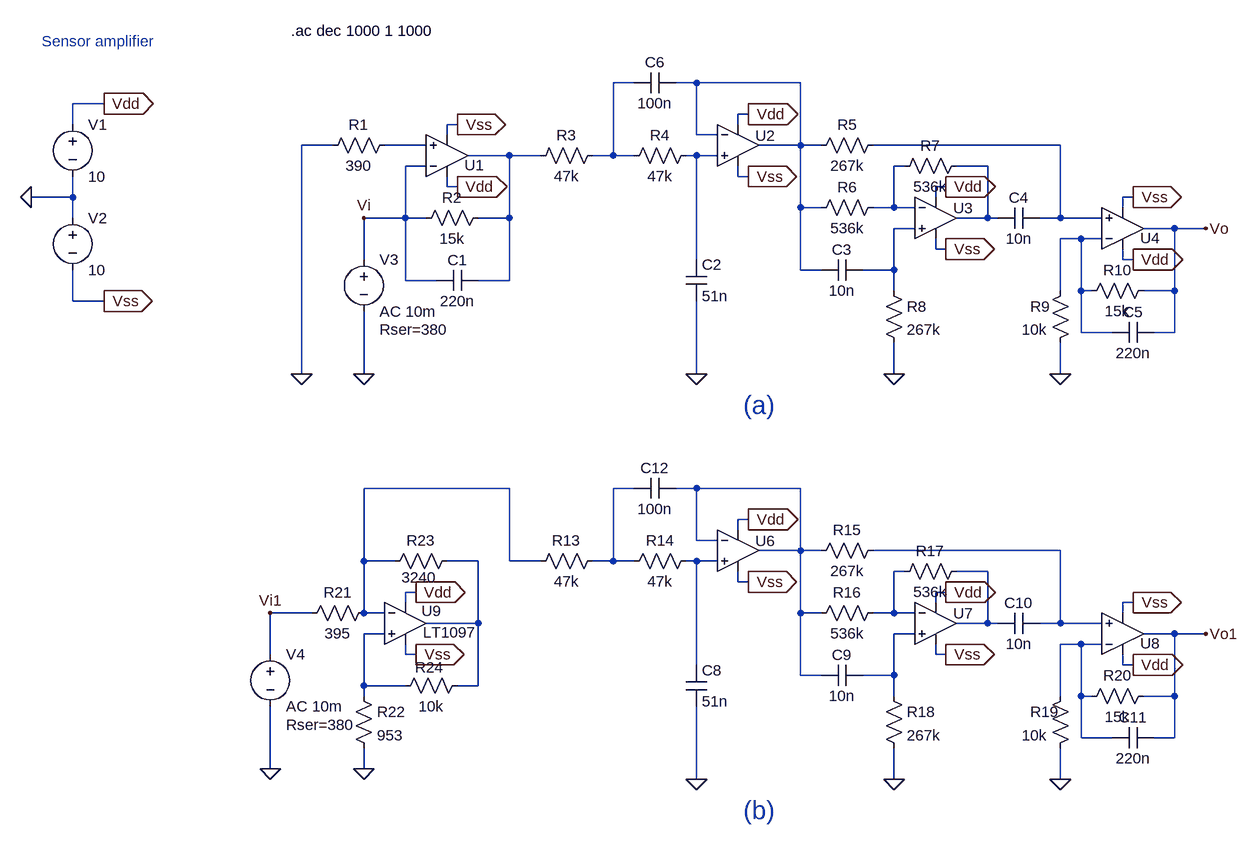
[diagram p0: schematic sensor amplifier2.asc]
sensor amplifier2.asc, the LTspice schematic file:
Version 4
SHEET 1 1816 1412
WIRE 880 -48 848 -48
WIRE 976 -48 944 -48
WIRE 1136 -48 976 -48
WIRE 64 -16 16 -16
WIRE 1056 0 1040 0
WIRE 16 16 16 -16
WIRE 608 16 592 16
WIRE 1040 16 1040 0
WIRE 592 32 592 16
WIRE 976 32 976 -48
WIRE 1008 32 976 32
WIRE 416 48 368 48
WIRE 560 48 496 48
WIRE 1136 48 1136 -48
WIRE 1136 48 1072 48
WIRE 1168 48 1136 48
WIRE 1536 48 1248 48
WIRE 688 64 624 64
WIRE 736 64 688 64
WIRE 848 64 848 -48
WIRE 848 64 816 64
WIRE 880 64 848 64
WIRE 976 64 960 64
WIRE 1008 64 976 64
WIRE 560 80 528 80
WIRE 1296 80 1280 80
WIRE 1424 80 1376 80
WIRE 1040 96 1040 80
WIRE 1056 96 1040 96
WIRE 592 112 592 96
WIRE 608 112 592 112
WIRE 1360 112 1344 112
WIRE 16 128 16 96
WIRE 16 128 -48 128
WIRE 1344 128 1344 112
WIRE 1648 128 1632 128
WIRE 1136 144 1136 48
WIRE 1168 144 1136 144
WIRE 1280 144 1280 80
WIRE 1280 144 1248 144
WIRE 1312 144 1280 144
WIRE 1632 144 1632 128
WIRE 16 160 16 128
WIRE 528 160 528 80
WIRE 528 160 464 160
WIRE 560 160 528 160
WIRE 688 160 688 64
WIRE 688 160 640 160
WIRE 1424 160 1424 80
WIRE 1424 160 1376 160
WIRE 1440 160 1424 160
WIRE 1536 160 1536 48
WIRE 1536 160 1504 160
WIRE 1600 160 1536 160
WIRE 1312 176 1280 176
WIRE 1712 176 1664 176
WIRE 1760 176 1712 176
WIRE 1568 192 1536 192
WIRE 1600 192 1568 192
WIRE 1344 208 1344 192
WIRE 1360 208 1344 208
WIRE 464 224 464 160
WIRE 976 224 976 64
WIRE 1632 224 1632 208
WIRE 1648 224 1632 224
WIRE 1136 240 1136 144
WIRE 1168 240 1136 240
WIRE 1280 240 1280 176
WIRE 1280 240 1232 240
WIRE 528 256 528 160
WIRE 576 256 528 256
WIRE 688 256 688 160
WIRE 688 256 640 256
WIRE 1280 272 1280 240
WIRE 1536 272 1536 192
WIRE 1568 272 1568 192
WIRE 1584 272 1568 272
WIRE 1712 272 1712 176
WIRE 1712 272 1664 272
WIRE 16 288 16 240
WIRE 64 288 16 288
WIRE 1568 336 1568 272
WIRE 1616 336 1568 336
WIRE 1712 336 1712 272
WIRE 1712 336 1680 336
WIRE 368 400 368 48
WIRE 464 400 464 304
WIRE 976 400 976 288
WIRE 1280 400 1280 352
WIRE 1536 400 1536 352
WIRE 688 576 464 576
WIRE 880 576 848 576
WIRE 976 576 944 576
WIRE 1136 576 976 576
WIRE 1056 624 1040 624
WIRE 1040 640 1040 624
WIRE 976 656 976 576
WIRE 1008 656 976 656
WIRE 1136 672 1136 576
WIRE 1136 672 1072 672
WIRE 1168 672 1136 672
WIRE 1536 672 1248 672
WIRE 464 688 464 576
WIRE 512 688 464 688
WIRE 640 688 592 688
WIRE 688 688 688 576
WIRE 736 688 688 688
WIRE 848 688 848 576
WIRE 848 688 816 688
WIRE 880 688 848 688
WIRE 976 688 960 688
WIRE 1008 688 976 688
WIRE 1296 704 1280 704
WIRE 1424 704 1376 704
WIRE 1040 720 1040 704
WIRE 1056 720 1040 720
WIRE 544 736 528 736
WIRE 1360 736 1344 736
WIRE 528 752 528 736
WIRE 1344 752 1344 736
WIRE 1648 752 1632 752
WIRE 384 768 320 768
WIRE 464 768 464 688
WIRE 496 768 464 768
WIRE 1136 768 1136 672
WIRE 1168 768 1136 768
WIRE 1280 768 1280 704
WIRE 1280 768 1248 768
WIRE 1312 768 1280 768
WIRE 1632 768 1632 752
WIRE 640 784 640 688
WIRE 640 784 560 784
WIRE 1424 784 1424 704
WIRE 1424 784 1376 784
WIRE 1440 784 1424 784
WIRE 1536 784 1536 672
WIRE 1536 784 1504 784
WIRE 1600 784 1536 784
WIRE 496 800 464 800
WIRE 1312 800 1280 800
WIRE 1712 800 1664 800
WIRE 1760 800 1712 800
WIRE 1568 816 1536 816
WIRE 1600 816 1568 816
WIRE 320 832 320 768
WIRE 528 832 528 816
WIRE 544 832 528 832
WIRE 1344 832 1344 816
WIRE 1360 832 1344 832
WIRE 976 848 976 688
WIRE 1632 848 1632 832
WIRE 1648 848 1632 848
WIRE 1136 864 1136 768
WIRE 1168 864 1136 864
WIRE 1280 864 1280 800
WIRE 1280 864 1232 864
WIRE 464 880 464 800
WIRE 528 880 464 880
WIRE 640 880 640 784
WIRE 640 880 608 880
WIRE 464 896 464 880
WIRE 1280 896 1280 864
WIRE 1536 896 1536 816
WIRE 1568 896 1568 816
WIRE 1584 896 1568 896
WIRE 1712 896 1712 800
WIRE 1712 896 1664 896
WIRE 1568 960 1568 896
WIRE 1616 960 1568 960
WIRE 1712 960 1712 896
WIRE 1712 960 1680 960
WIRE 320 1008 320 912
WIRE 464 1008 464 976
WIRE 976 1024 976 912
WIRE 1280 1024 1280 976
WIRE 1536 1024 1536 976
FLAG -48 128 0
FLAG 64 -16 Vdd
IOPIN 64 -16 Out
FLAG 64 288 Vss
IOPIN 64 288 Out
FLAG 608 112 Vdd
IOPIN 608 112 Out
FLAG 608 16 Vss
IOPIN 608 16 Out
FLAG 464 400 0
FLAG 368 400 0
FLAG 1056 0 Vdd
IOPIN 1056 0 Out
FLAG 1056 96 Vss
IOPIN 1056 96 Out
FLAG 976 400 0
FLAG 1360 112 Vdd
IOPIN 1360 112 Out
FLAG 1360 208 Vss
IOPIN 1360 208 Out
FLAG 1280 400 0
FLAG 1648 224 Vdd
IOPIN 1648 224 Out
FLAG 1648 128 Vss
IOPIN 1648 128 Out
FLAG 1536 400 0
FLAG 1760 176 Vo
FLAG 464 160 Vi
FLAG 1056 624 Vdd
IOPIN 1056 624 Out
FLAG 1056 720 Vss
IOPIN 1056 720 Out
FLAG 976 1024 0
FLAG 1360 736 Vdd
IOPIN 1360 736 Out
FLAG 1360 832 Vss
IOPIN 1360 832 Out
FLAG 1280 1024 0
FLAG 1648 848 Vdd
IOPIN 1648 848 Out
FLAG 1648 752 Vss
IOPIN 1648 752 Out
FLAG 1536 1024 0
FLAG 1760 800 Vo1
FLAG 544 736 Vdd
IOPIN 544 736 Out
FLAG 544 832 Vss
IOPIN 544 832 Out
FLAG 464 1008 0
FLAG 320 1008 0
FLAG 320 768 Vi1
SYMBOL voltage 16 0 R0
WINDOW 123 0 0 Left 0
WINDOW 39 0 0 Left 0
SYMATTR InstName V1
SYMATTR Value 10
SYMBOL voltage 16 144 R0
WINDOW 123 0 0 Left 0
WINDOW 39 0 0 Left 0
SYMATTR InstName V2
SYMATTR Value 10
SYMBOL OpAmps\\UniversalOpamp2 592 64 M180
WINDOW 0 27 -15 Left 2
SYMATTR InstName U1
SYMBOL res 512 32 R90
WINDOW 0 0 56 VBottom 2
WINDOW 3 32 56 VTop 2
SYMATTR InstName R1
SYMATTR Value 390
SYMBOL res 656 144 R90
WINDOW 0 0 56 VBottom 2
WINDOW 3 32 56 VTop 2
SYMATTR InstName R2
SYMATTR Value 15k
SYMBOL cap 640 240 R90
WINDOW 0 0 32 VBottom 2
WINDOW 3 32 32 VTop 2
SYMATTR InstName C1
SYMATTR Value 220n
SYMBOL voltage 464 208 R0
WINDOW 123 0 0 Left 0
WINDOW 39 24 124 Left 2
SYMATTR SpiceLine Rser=380
SYMATTR InstName V3
SYMATTR Value AC 10m
SYMBOL res 832 48 R90
WINDOW 0 0 56 VBottom 2
WINDOW 3 32 56 VTop 2
SYMATTR InstName R3
SYMATTR Value 47k
SYMBOL res 976 48 R90
WINDOW 0 0 56 VBottom 2
WINDOW 3 32 56 VTop 2
SYMATTR InstName R4
SYMATTR Value 47k
SYMBOL OpAmps\\UniversalOpamp2 1040 48 R0
WINDOW 0 27 -15 Left 2
SYMATTR InstName U2
SYMBOL cap 960 224 R0
SYMATTR InstName C2
SYMATTR Value 51n
SYMBOL OpAmps\\UniversalOpamp2 1344 160 R0
WINDOW 0 27 -15 Left 2
SYMATTR InstName U3
SYMBOL res 1264 32 R90
WINDOW 0 0 56 VBottom 2
WINDOW 3 32 56 VTop 2
SYMATTR InstName R5
SYMATTR Value 267k
SYMBOL res 1264 128 R90
WINDOW 0 0 56 VBottom 2
WINDOW 3 32 56 VTop 2
SYMATTR InstName R6
SYMATTR Value 536k
SYMBOL res 1392 64 R90
WINDOW 0 0 56 VBottom 2
WINDOW 3 32 56 VTop 2
SYMATTR InstName R7
SYMATTR Value 536k
SYMBOL cap 1232 224 R90
WINDOW 0 0 32 VBottom 2
WINDOW 3 32 32 VTop 2
SYMATTR InstName C3
SYMATTR Value 10n
SYMBOL res 1264 256 R0
SYMATTR InstName R8
SYMATTR Value 267k
SYMBOL cap 1504 144 R90
WINDOW 0 0 32 VBottom 2
WINDOW 3 32 32 VTop 2
SYMATTR InstName C4
SYMATTR Value 10n
SYMBOL OpAmps\\UniversalOpamp2 1632 176 M180
WINDOW 0 27 -15 Left 2
SYMATTR InstName U4
SYMBOL res 1552 256 M0
WINDOW 0 62 40 Right 2
SYMATTR InstName R9
SYMATTR Value 10k
SYMBOL res 1680 256 R90
WINDOW 0 0 56 VBottom 2
WINDOW 3 32 56 VTop 2
SYMATTR InstName R10
SYMATTR Value 15k
SYMBOL cap 1680 320 R90
WINDOW 0 0 32 VBottom 2
WINDOW 3 32 32 VTop 2
SYMATTR InstName C5
SYMATTR Value 220n
SYMBOL cap 944 -64 R90
WINDOW 0 0 32 VBottom 2
WINDOW 3 32 32 VTop 2
SYMATTR InstName C6
SYMATTR Value 100n
SYMBOL voltage 320 816 R0
WINDOW 123 0 0 Left 0
WINDOW 39 24 124 Left 2
SYMATTR SpiceLine Rser=380
SYMATTR InstName V4
SYMATTR Value AC 10m
SYMBOL res 832 672 R90
WINDOW 0 0 56 VBottom 2
WINDOW 3 32 56 VTop 2
SYMATTR InstName R13
SYMATTR Value 47k
SYMBOL res 976 672 R90
WINDOW 0 0 56 VBottom 2
WINDOW 3 32 56 VTop 2
SYMATTR InstName R14
SYMATTR Value 47k
SYMBOL OpAmps\\UniversalOpamp2 1040 672 R0
WINDOW 0 27 -15 Left 2
SYMATTR InstName U6
SYMBOL cap 960 848 R0
SYMATTR InstName C8
SYMATTR Value 51n
SYMBOL OpAmps\\UniversalOpamp2 1344 784 R0
WINDOW 0 27 -15 Left 2
SYMATTR InstName U7
SYMBOL res 1264 656 R90
WINDOW 0 0 56 VBottom 2
WINDOW 3 32 56 VTop 2
SYMATTR InstName R15
SYMATTR Value 267k
SYMBOL res 1264 752 R90
WINDOW 0 0 56 VBottom 2
WINDOW 3 32 56 VTop 2
SYMATTR InstName R16
SYMATTR Value 536k
SYMBOL res 1392 688 R90
WINDOW 0 0 56 VBottom 2
WINDOW 3 32 56 VTop 2
SYMATTR InstName R17
SYMATTR Value 536k
SYMBOL cap 1232 848 R90
WINDOW 0 0 32 VBottom 2
WINDOW 3 32 32 VTop 2
SYMATTR InstName C9
SYMATTR Value 10n
SYMBOL res 1264 880 R0
SYMATTR InstName R18
SYMATTR Value 267k
SYMBOL cap 1504 768 R90
WINDOW 0 0 32 VBottom 2
WINDOW 3 32 32 VTop 2
SYMATTR InstName C10
SYMATTR Value 10n
SYMBOL OpAmps\\UniversalOpamp2 1632 800 M180
WINDOW 0 27 -15 Left 2
SYMATTR InstName U8
SYMBOL res 1552 880 M0
WINDOW 0 62 40 Right 2
SYMATTR InstName R19
SYMATTR Value 10k
SYMBOL res 1680 880 R90
WINDOW 0 0 56 VBottom 2
WINDOW 3 32 56 VTop 2
SYMATTR InstName R20
SYMATTR Value 15k
SYMBOL cap 1680 944 R90
WINDOW 0 0 32 VBottom 2
WINDOW 3 32 32 VTop 2
SYMATTR InstName C11
SYMATTR Value 220n
SYMBOL cap 944 560 R90
WINDOW 0 0 32 VBottom 2
WINDOW 3 32 32 VTop 2
SYMATTR InstName C12
SYMATTR Value 100n
SYMBOL OpAmps\\LT1097 528 720 R0
WINDOW 0 25 45 Left 2
WINDOW 3 27 78 Left 2
SYMATTR InstName U9
SYMBOL res 480 752 R90
WINDOW 0 0 56 VBottom 2
WINDOW 3 32 56 VTop 2
SYMATTR InstName R21
SYMATTR Value 395
SYMBOL res 448 880 R0
SYMATTR InstName R22
SYMATTR Value 953
SYMBOL res 608 672 R90
WINDOW 0 0 56 VBottom 2
WINDOW 3 26 59 VTop 2
SYMATTR InstName R23
SYMATTR Value 3240
SYMBOL res 624 864 R90
WINDOW 0 3 59 VBottom 2
WINDOW 3 32 56 VTop 2
SYMATTR InstName R24
SYMATTR Value 10k
TEXT 352 -128 Left 2 !.ac dec 1000 1 1000
TEXT -32 -112 Left 2 ;Sensor amplifier
TEXT 1048 448 Left 4 ;(a)
TEXT 1048 1072 Left 4 ;(b)

The netlist it stands for:
* sensor amplifier2.asc
V1 Vdd 0 10
V2 0 Vss 10
XU1 N003 Vi Vdd Vss N005 level.2 Avol=1Meg GBW=10Meg Slew=10Meg ilimit=25m rail=0 Vos=0 phimargin=45 en=0 enk=0 in=0 ink=0 Rin=500Meg  ; pins IN+ IN- V+ V- OUT
R1 N003 0 390
R2 N005 Vi 15k
C1 N005 Vi 220n
V3 Vi 0 AC 10m Rser=380
R3 N001 N005 47k
R4 N006 N001 47k
XU2 N006 N002 Vdd Vss N002 level.2 Avol=1Meg GBW=10Meg Slew=10Meg ilimit=25m rail=0 Vos=0 phimargin=45 en=0 enk=0 in=0 ink=0 Rin=500Meg  ; pins IN+ IN- V+ V- OUT
C2 N006 0 51n
XU3 N009 N007 Vdd Vss N008 level.2 Avol=1Meg GBW=10Meg Slew=10Meg ilimit=25m rail=0 Vos=0 phimargin=45 en=0 enk=0 in=0 ink=0 Rin=500Meg  ; pins IN+ IN- V+ V- OUT
R5 N004 N002 267k
R6 N007 N002 536k
R7 N008 N007 536k
C3 N009 N002 10n
R8 N009 0 267k
C4 N004 N008 10n
XU4 N004 N010 Vdd Vss Vo level.2 Avol=1Meg GBW=10Meg Slew=10Meg ilimit=25m rail=0 Vos=0 phimargin=45 en=0 enk=0 in=0 ink=0 Rin=500Meg  ; pins IN+ IN- V+ V- OUT
R9 N010 0 10k
R10 Vo N010 15k
C5 Vo N010 220n
C6 N002 N001 100n
V4 Vi1 0 AC 10m Rser=380
R13 N012 N011 47k
R14 N016 N012 47k
XU6 N016 N013 Vdd Vss N013 level.2 Avol=1Meg GBW=10Meg Slew=10Meg ilimit=25m rail=0 Vos=0 phimargin=45 en=0 enk=0 in=0 ink=0 Rin=500Meg  ; pins IN+ IN- V+ V- OUT
C8 N016 0 51n
XU7 N020 N017 Vdd Vss N018 level.2 Avol=1Meg GBW=10Meg Slew=10Meg ilimit=25m rail=0 Vos=0 phimargin=45 en=0 enk=0 in=0 ink=0 Rin=500Meg  ; pins IN+ IN- V+ V- OUT
R15 N014 N013 267k
R16 N017 N013 536k
R17 N018 N017 536k
C9 N020 N013 10n
R18 N020 0 267k
C10 N014 N018 10n
XU8 N014 N021 Vdd Vss Vo1 level.2 Avol=1Meg GBW=10Meg Slew=10Meg ilimit=25m rail=0 Vos=0 phimargin=45 en=0 enk=0 in=0 ink=0 Rin=500Meg  ; pins IN+ IN- V+ V- OUT
R19 N021 0 10k
R20 Vo1 N021 15k
C11 Vo1 N021 220n
C12 N013 N012 100n
XU9 N019 N011 Vdd Vss N015 LT1097  ; pins In+ In- V+ V- OUT
R21 N011 Vi1 395
R22 N019 0 953
R23 N015 N011 3240
R24 N015 N019 10k
.ac dec 1000 1 1000
* Sensor amplifier
* (a)
* (b)
.lib UniversalOpamps2.sub
.backanno
.end